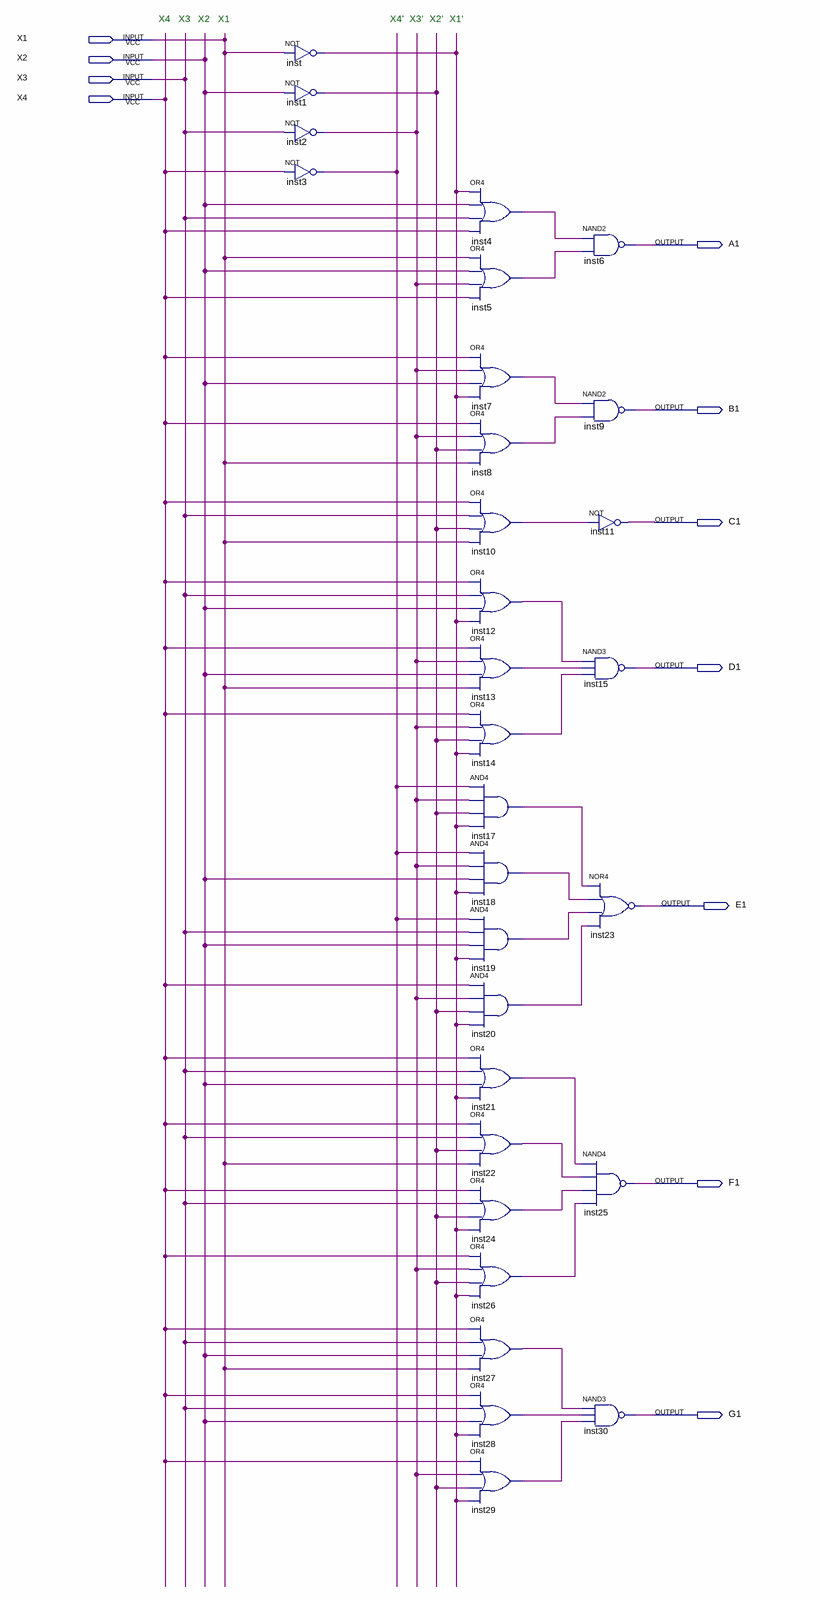
[diagram p0: schematic sheet]
// Quartus schematic Indicator1.bdf as structural Verilog: 30 symbols, 11 pins
module Indicator1 (
  input  X1,
  input  X2,
  input  X3,
  input  X4,
  output A1,
  output B1,
  output C1,
  output D1,
  output E1,
  output F1,
  output G1
);

  wire inst1_out, inst2_out, inst3_out, inst4_out, inst5_out, inst7_out, inst8_out, inst10_out, inst12_out,
       inst13_out, inst14_out, inst17_out, inst18_out, inst19_out, inst20_out, inst21_out, inst22_out,
       inst24_out, inst26_out, inst27_out, inst28_out, inst29_out, inst_out;

  not inst (inst_out, X1);
  not inst1 (inst1_out, X2);
  not inst2 (inst2_out, X3);
  not inst3 (inst3_out, X4);
  or inst4 (inst4_out, inst_out, X2, X3, X4);
  or inst5 (inst5_out, X1, X2, inst2_out, X4);
  or inst7 (inst7_out, X4, inst2_out, X2, inst_out);
  or inst8 (inst8_out, X4, inst2_out, inst1_out, X1);
  or inst10 (inst10_out, X4, X3, inst1_out, X1);
  or inst12 (inst12_out, X4, X3, X2, inst_out);
  or inst13 (inst13_out, X4, inst2_out, X2, X1);
  or inst14 (inst14_out, X4, inst2_out, inst1_out, inst_out);
  and inst17 (inst17_out, inst3_out, inst2_out, inst1_out, inst_out);
  and inst18 (inst18_out, inst3_out, inst2_out, X2, inst_out);
  and inst19 (inst19_out, inst3_out, X3, X2, inst_out);
  and inst20 (inst20_out, X4, inst2_out, inst1_out, inst_out);
  or inst21 (inst21_out, X4, X3, X2, inst_out);
  or inst22 (inst22_out, X4, X3, inst1_out, X1);
  or inst24 (inst24_out, X4, X3, inst1_out, inst_out);
  or inst26 (inst26_out, X4, inst2_out, inst1_out, inst_out);
  or inst27 (inst27_out, X4, X3, X2, X1);
  or inst28 (inst28_out, X4, X3, X2, inst_out);
  or inst29 (inst29_out, X4, inst2_out, inst1_out, inst_out);
  nand inst6 (A1, inst4_out, inst5_out);
  nand inst9 (B1, inst7_out, inst8_out);
  not inst11 (C1, inst10_out);
  nand inst15 (D1, inst12_out, inst13_out, inst14_out);
  nor inst23 (E1, inst17_out, inst18_out, inst19_out, inst20_out);
  nand inst25 (F1, inst21_out, inst22_out, inst24_out, inst26_out);
  nand inst30 (G1, inst27_out, inst28_out, inst29_out);

  // Notes on the sheet:
  //   X4
  //   X3
  //   X2
  //   X1
  //   X4'
  //   X3'
  //   X2'
  //   X1'
endmodule
